# EAGLE design startlight.decoder (EAGLE 7.3.0)
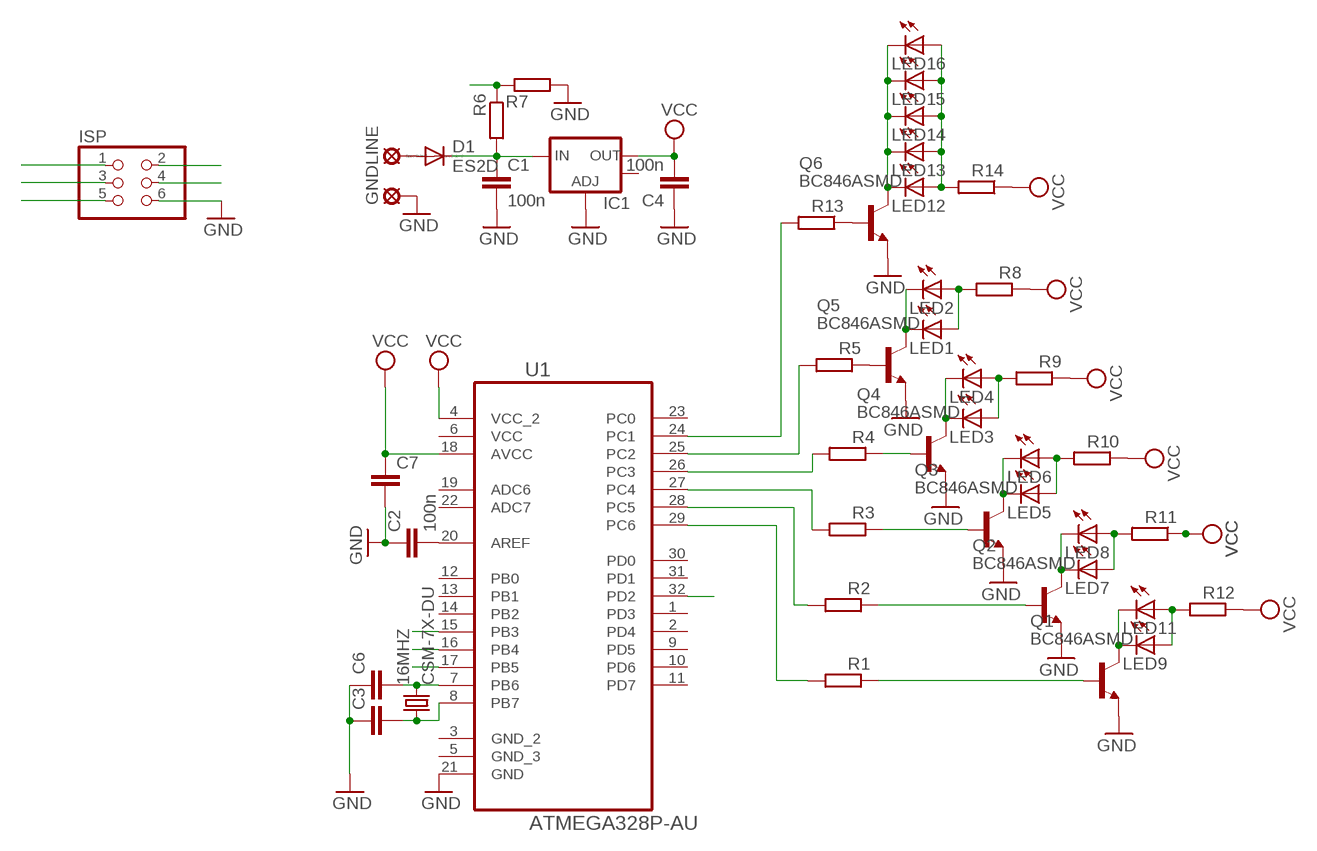
[diagram p0: schematic, sheet 1]

## Parts
16MHZ  CSM-7X-DU  [CSM-7X-DU]
C1  100n  C-EU025-040X050  [C025-040X050]
C2  100n  C-EUC1206  [C1206]
C3  C-EUC0805K  [C0805K]
C4  100n  C-EUC1206  [C1206]
C6  C-EUC0805K  [C0805K]
C7  C-EU025-040X050  [C025-040X050]
D1  ES2D  [SMB]
GND  SE11  [SE11]
IC1  V_REG_LM1117SOT223  [SOT223]
ISP  PINHD-2X3  [2X03]
LED1  LED5MM  [LED5MM]
LED2  LED5MM  [LED5MM]
LED3  LED5MM  [LED5MM]
LED4  LED5MM  [LED5MM]
LED5  LED5MM  [LED5MM]
LED6  LED5MM  [LED5MM]
LED7  LED5MM  [LED5MM]
LED8  LED5MM  [LED5MM]
LED9  LED5MM  [LED5MM]
LED11  LED5MM  [LED5MM]
LED12  LED5MM  [LED5MM]
LED13  LED5MM  [LED5MM]
LED14  LED5MM  [LED5MM]
LED15  LED5MM  [LED5MM]
LED16  LED5MM  [LED5MM]
LINE  SE11  [SE11]
Q1  BC846ASMD  [SOT23]
Q2  BC846ASMD  [SOT23]
Q3  BC846ASMD  [SOT23]
Q4  BC846ASMD  [SOT23]
Q5  BC846ASMD  [SOT23]
Q6  BC846ASMD  [SOT23]
R1  R-EU_R1206  [R1206]
R2  R-EU_R1206  [R1206]
R3  R-EU_R1206  [R1206]
R4  R-EU_R1206  [R1206]
R5  R-EU_R1206  [R1206]
R6  R-EU_R1206  [R1206]
R7  R-EU_R1206  [R1206]
R8  R-EU_R1206  [R1206]
R9  R-EU_R1206  [R1206]
R10  R-EU_R1206  [R1206]
R11  R-EU_R1206  [R1206]
R12  R-EU_R1206  [R1206]
R13  R-EU_R1206  [R1206]
R14  R-EU_R1206  [R1206]
U1  ATMEGA328P-AU  [QFP80P900X900X120-32N]

## Nets
GND: C1.2 C2.1 C3.1 C4.1 C6.1 C7.2 GND.MP IC1.1(ADJ) ISP.6 Q1.2(E) Q2.2(E) Q3.2(E) Q4.2(E) Q5.2(E) Q6.2(E) R7.2 U1.21(GND)
INT0: R6.1 R7.1 U1.32(PD2)
MISO: ISP.1 U1.16(PB4)
MOSI: ISP.4 U1.15(PB3)
N$1: R5.2 U1.25(PC2)
N$2: R4.2 U1.26(PC3)
N$3: R3.2 U1.27(PC4)
N$4: R2.2 U1.28(PC5)
N$5: R1.2 U1.29(PC6)
N$6: Q5.1(B) R5.1
N$7: Q4.1(B) R4.1
N$8: Q3.1(B) R3.1
N$9: Q2.1(B) R2.1
N$10: Q1.1(B) R1.1
N$11: D1.A LINE.MP
N$12: C1.1 D1.C IC1.3(IN) R6.2
N$13: C2.2 U1.20(AREF)
N$14: LED1.K(C) LED2.K(C) Q5.3(C)
N$15: LED3.K(C) LED4.K(C) Q4.3(C)
N$16: LED1.A LED2.A R8.2
N$17: LED5.K(C) LED6.K(C) Q3.3(C)
N$18: LED3.A LED4.A R9.2
N$19: LED7.K(C) LED8.K(C) Q2.3(C)
N$20: LED5.A LED6.A R10.2
N$21: LED9.K(C) LED11.K(C) Q1.3(C)
N$22: LED7.A LED8.A R11.2
N$23: LED9.A LED11.A R12.2
N$24: Q6.1(B) R13.1
N$25: R13.2 U1.24(PC1)
N$26: LED12.K(C) LED13.K(C) LED14.K(C) LED15.K(C) LED16.K(C) Q6.3(C)
N$28: LED12.A LED13.A LED14.A LED15.A LED16.A R14.2
N$30: 16MHZ.2 C6.2 U1.7(PB6)
N$31: 16MHZ.1 C3.2 U1.8(PB7)
RESET: ISP.5
SCK: ISP.3 U1.17(PB5)
VCC: C4.2 C7.1 IC1.2(OUT) ISP.2 R8.1 R9.1 R10.1 R11.1 R12.1 R14.1 U1.4(VCC_2) U1.18(AVCC)
Unconnected: IC1.4(OUT) U1.1(PD3) U1.2(PD4) U1.3(GND_2) U1.5(GND_3) U1.9(PD5) U1.10(PD6) U1.11(PD7) U1.12(PB0) U1.13(PB1) U1.14(PB2) U1.19(ADC6) U1.22(ADC7) U1.23(PC0) U1.30(PD0) U1.31(PD1)

## Power pins joined to a net without a drawn wire
VCC: U1.6(VCC)

## Library data of the parts
16MHZ = quarz:CSM-7X-DU: SMD CRYSTAL Source: www.ecsxtal.com .. Crystal 3.6864MHz CSM_7X_DU.PDF; OC_FARNELL: unknown; OC_NEWARK: unknown
C1-C4 C6 C7 = rcl:C-EU: CAPACITOR, European symbol
D1 = diode:ES2D: DIODE super fast rectifier, 2 A
GND LINE = solpad:SE11: SOLDER PAD RTM, drill 1,1mm, distributor Buerklin, 07F810
IC1 = sparkfun:V_REG_LM1117: Voltage Regulator LM1117 Standard adjustable voltage regulator but in SMD form. Spark Fun Electronics SKU : COM-00595
ISP = pinhead:PINHD-2X3: PIN HEADER
LED1-LED9 LED11-LED16 = led:LED: LED OSRAM: - CHIPLED LG R971, LG N971, LY N971, LG Q971, LY Q971, LO R971, LY R971 LH N974, LH R974 LS Q976, LO Q976, LY Q976 LO Q996 - Hyper CHIPLED LW Q18S LB Q993, LB Q99A, LB R99A - SideLED LS A670, LO A670, LY A670, LG A670, LP A670 LB A673, LV A673, LT A673, LW A673 LH A674 LY A675 LS A676, LA A676, LO A676, LY A676, LW A676 LS A679, LY A679, LG A679 - Hyper Micro SIDELED® LS Y876, LA Y876, LO Y876, LY Y876 LT Y87S - SmartLED LW L88C, LW L88S LB L89C, LB L89S, LG L890 LS L89K, LO L89K, LY L89K LS L896, LA L896, LO L896, LY L896 - TOPLED LS T670, LO T670, LY T670, LG T670, LP T670 LSG T670, LSP T670, LSY T670, LOP T670, LYG T670 LG T671, LOG T671, LSG T671 LB T673, LV T673, LT T673, LW T673 LH T674 LS T676, LA T676, LO T676, LY T676, LB T676, LH T676, LSB T676, LW T676 LB T67C, LV T67C, LT T67C, LS T67K, LO T67K, LY T67K, LW E67C LS E67B, LA E67B, LO E67B, LY E67B, LB E67C, LV E67C, LT E67C LW T67C LS T679, LY T679, LG T679 LS T770, LO T770, LY T770, LG T770, LP T770 LB T773, LV T773, LT T773, LW T773 LH T774 LS E675, LA E675, LY E675, LS T675 LS T776, LA T776, LO T776, LY T776, LB T776 LHGB T686 LT T68C, LB T68C - Hyper Mini TOPLED® LB M676 - Mini TOPLED Santana® LG M470 LS M47K, LO M47K, LY M47K Source: http://www.osram.convergy.de LUXEON: - LUMILED® LXK2-PW12-R00, LXK2-PW12-S00, LXK2-PW14-U00, LXK2-PW14-V00 LXK2-PM12-R00, LXK2-PM12-S00, LXK2-PM14-U00 LXK2-PE12-Q00, LXK2-PE12-R00, LXK2-PE12-S00, LXK2-PE14-T00, LXK2-PE14-U00 LXK2-PB12-K00, LXK2-PB12-L00, LXK2-PB12-M00, LXK2-PB14-N00, LXK2-PB14-P00, LXK2-PB14-Q00 LXK2-PR12-L00, LXK2-PR12-M00, LXK2-PR14-Q00, LXK2-PR14-R00 LXK2-PD12-Q00, LXK2-PD12-R00, LXK2-PD12-S00 LXK2-PH12-R00, LXK2-PH12-S00 LXK2-PL12-P00, LXK2-PL12-Q00, LXK2-PL12-R00 Source: www.luxeon.com KINGBRIGHT: KA-3528ASYC Source: www.kingbright.com
Q1-Q6 = transistor-npn:BC846*: NPN Transistor
R1-R14 = rcl:R-EU_: RESISTOR, European symbol
U1 = atmega328:ATMEGA328P-AU: 8-bit Microcontroller with In-System Programmable Flash; MPN: ATMEGA328P-AU; OC_FARNELL: 1715486; OC_NEWARK: 14R4631; PACKAGE: TQFP-32; SUPPLIER: Atmel

## Net classes
0 default: width 0.406 mm, drill 0.406 mm, clearance 0.406 mm

## Board
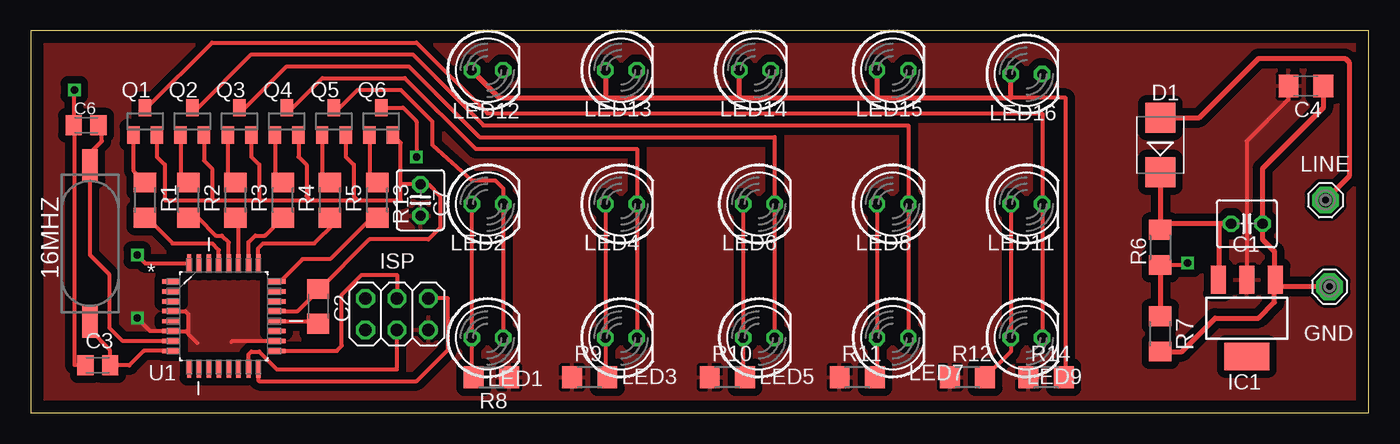
[diagram p1: board, top side]
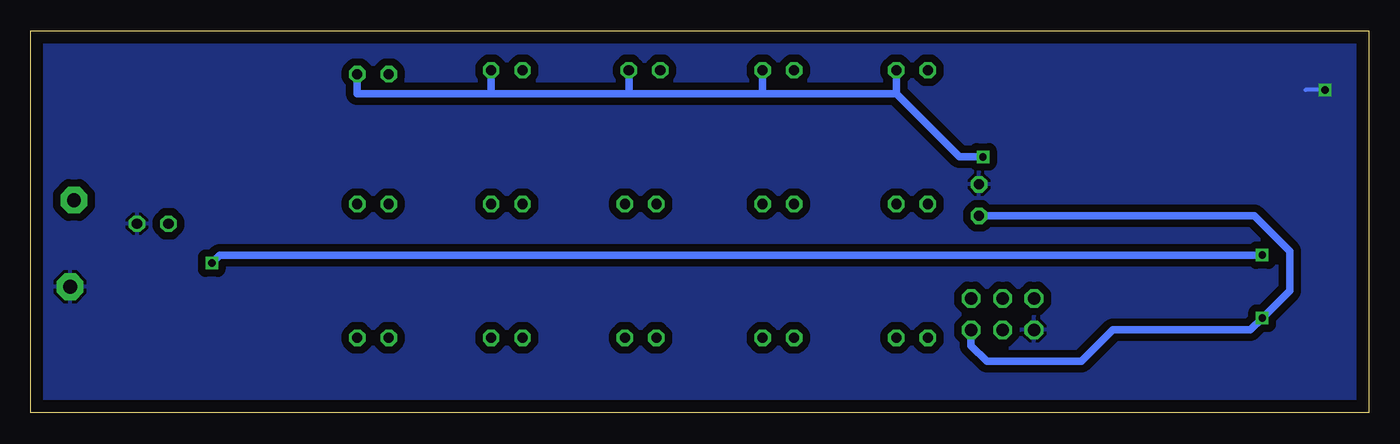
[diagram p2: board, bottom side, seen from below]

Size 107.93 x 30.79 mm. Coordinates in mm from the lower left corner, seen from the top.
Outline: 0,0 107.93,0 107.93,30.79 0,30.79 0,0
Copper layers (1*16): Top 0.035mm / dielectric 1.5mm / Bottom 0.035mm
Design rules "default": minimum track width 10mil, minimum drill 24mil, track to track 8mil, track to pad 8mil, pad to pad 8mil, via to via 8mil, smd to smd 8mil, copper to edge 40mil, drill to drill 8mil, minimum pad ring 10mil, minimum via ring 8mil, stop-mask expansion 4mil, vias tented up to drill 0mil, thermal gap 10mil

### Footprints (pad centres in the part's own frame; a part is rotated, then mirrored left to right if it is on the bottom)
CSM-7X-DU = smd 2.54 x 1.27: 1 -6.338,0; 2 6.338,0
C025-040X050 = drill 0.813 octagon: 1 -1.27,0; 2 1.27,0
C1206 = smd 1.6 x 1.8: 1 -1.4,0; 2 1.4,0
C0805K = smd 1.3 x 1.6: 1 -1,0; 2 1,0
SMB = smd 2.4 x 2.4: A 2.2,0; C -2.2,0
SE11 = drill 1.118 pad 2.159 octagon: MP 0,0
SOT223 = smd 1.219 x 2.235: 1 -2.311,-3.099; 2 0,-3.099; 3 2.311,-3.099 | smd 3.6 x 2.2: 4 0,3.099
2X03 = drill 1.016 octagon: 1 -2.54,-1.27; 2 -2.54,1.27; 3 0,-1.27; 4 0,1.27; 5 2.54,-1.27; 6 2.54,1.27
LED5MM = drill 0.813 octagon: A -1.27,0; K 1.27,0
SOT23 = smd 1 x 1.4: 1 -0.95,-1.1; 2 0.95,-1.1; 3 0,1.1
R1206 = smd 1.6 x 1.803: 1 -1.422,0; 2 1.422,0
QFP80P900X900X120-32N = smd 1.473 x 0.356: 1 -4.242,2.794; 2 -4.242,2.007; 3 -4.242,1.194; 4 -4.242,0.406; 5 -4.242,-0.406; 6 -4.242,-1.194; 7 -4.242,-2.007; 8 -4.242,-2.794; 17 4.242,-2.794; 18 4.242,-2.007; 19 4.242,-1.194; 20 4.242,-0.406; 21 4.242,0.406; 22 4.242,1.194; 23 4.242,2.007; 24 4.242,2.794 | smd 0.356 x 1.473: 9 -2.794,-4.242; 10 -2.007,-4.242; 11 -1.194,-4.242; 12 -0.406,-4.242; 13 0.406,-4.242; 14 1.194,-4.242; 15 2.007,-4.242; 16 2.794,-4.242; 25 2.794,4.242; 26 2.007,4.242; 27 1.194,4.242; 28 0.406,4.242; 29 -0.406,4.242; 30 -1.194,4.242; 31 -2.007,4.242; 32 -2.794,4.242

### Placement (x,y rotation side)
16MHZ  4.76,13.65 90 top
C1  98.11,15.24 0 top
C2  23.18,8.57 270 top
C3  5.4,3.81 0 top
C4  102.87,26.35 180 top
C6  4.45,23.18 0 top
C7  31.43,17.14 90 top
D1  91.12,21.59 90 top
GND  104.78,10.16 0 top
IC1  98.11,7.62 180 top
ISP  29.53,7.94 180 top
LED1  36.83,6.03 0 top
LED2  36.83,16.83 0 top
LED3  47.62,6.03 0 top
LED4  47.62,16.83 0 top
LED5  58.74,6.03 0 top
LED6  58.74,16.83 0 top
LED7  69.53,6.03 0 top
LED8  69.53,16.83 0 top
LED9  80.33,6.03 0 top
LED11  80.33,16.83 0 top
LED12  36.83,27.62 0 top
LED13  47.62,27.62 0 top
LED14  58.42,27.62 0 top
LED15  69.53,27.62 0 top
LED16  80.33,27.3 0 top
LINE  104.46,17.14 0 top
Q1  9.21,23.5 0 top
Q2  13.02,23.5 0 top
Q3  16.83,23.5 0 top
Q4  20.64,23.5 0 top
Q5  24.45,23.5 0 top
Q6  28.26,23.5 0 top
R1  9.21,17.14 270 top
R2  12.7,17.14 270 top
R3  16.51,17.14 270 top
R4  20.32,17.14 270 top
R5  24.13,17.14 270 top
R6  91.12,13.34 90 top
R7  91.12,6.35 270 top
R8  37.15,2.86 180 top
R9  45.09,2.86 0 top
R10  56.2,2.86 0 top
R11  66.67,2.86 0 top
R12  75.56,2.86 0 top
R13  27.94,17.14 270 top
R14  81.92,2.86 0 top
U1  15.56,7.78 0 top

### Tracks (layer width: path | path; a pad name or v marks a point on that pad's centre or on a via)
GND  (via drill 0.6 pad 0.61)
  Top 0.305: 14.61,17.14 10.79,17.14 10.79,20 10.16,20.64 Q1.2 | 14.61,17.14 18.41,17.14 | 18.41,17.14 22.54,17.14 | 22.54,17.14 26.35,17.14 | 26.35,17.14 29.84,17.14 29.84,18.41 | 29.84,18.41 29.84,21.76 Q6.2 | 29.84,18.41 C7.2 32.07,18.41 33.02,17.46 33.02,14.92 32.07,13.97 27.3,13.97 23.31,9.97 C2.1 23.68,9.84 23.18,9.84 21.52,8.19 U1.21 | C3.1 3.81,3.81 3.76,3.86 3.49,3.86 3.49,23.18 | C6.1 3.49,23.18 | 3.49,23.18 v3.49,26.04 | Q2.2 13.97,20.32 14.61,19.68 14.61,17.14 | Q3.2 17.78,20.64 18.41,20 18.41,17.14 | Q4.2 21.59,20.64 22.23,20 22.23,17.46 22.54,17.14 | Q5.2 25.4,20.64 26.04,20 26.04,17.46 26.35,17.14
  Top 0.406: GND.MP 100.98,10.16 100.81,10.32 | 100.81,10.32 IC1.1 100.33,10.81 100.33,13.02 99.38,13.97 C1.2 99.38,19.68 104.27,24.58 C4.1 | R7.2 92.88,4.93 95.57,7.62 99.06,7.62 100.33,8.89 100.33,9.84 100.81,10.32
  Bottom 0.305: v3.49,26.04 5.08,26.04
  pour Bottom (isolate 0.61): 0,0 0,30.8 107.95,30.48 107.95,-0.32
INT0  (via drill 0.6 pad 0.61)
  Top 0.305: 12.72,12.06 U1.32 9.25,12.02 v8.57,12.7 | R6.1 93.19,11.91 v93.34,12.06
  Top 0.406: R6.1 R7.1
  Bottom 0.61: v8.57,12.7 92.71,12.7 v93.34,12.06
MISO
  Top 0.305: ISP.1 33.66,9.21 33.66,5.08 31.11,2.54 18.41,2.54 18.35,2.6 U1.16
MOSI
  Top 0.305: ISP.4 29.53,3.49 19.84,3.49 18.41,4.92 17.78,4.92 17.56,4.71 U1.15
N$1
  Top 0.305: R5.2 24.45,15.24 22.86,13.65 18.73,13.65 18.35,13.27 U1.25
N$2
  Top 0.305: U1.26 17.56,13.75 18.1,14.29 18.88,14.29 R4.2
N$3
  Top 0.305: U1.27 16.75,15.33 R3.2
N$4
  Top 0.305: 12.85,15.72 R2.2 13.49,15.72 14.92,14.29 15.4,14.29 15.96,13.73 U1.28
N$5
  Top 0.305: U1.29 15.15,13.11 14.61,13.65 11.43,13.65 9.36,15.72 R1.2
N$6
  Top 0.305: Q5.1 23.5,19.2 R5.1
N$7
  Top 0.305: Q4.1 19.69,19.2 R4.1
N$8
  Top 0.305: Q3.1 15.88,19.2 R3.1
N$9
  Top 0.305: Q2.1 12.07,19.2 R2.1
N$10
  Top 0.305: Q1.1 8.26,19.52 R1.1
N$11
  Top 0.406: D1.A 94.28,23.79 99.06,28.57 106.05,28.57 106.36,28.26 106.36,19.05 LINE.MP
N$12
  Top 0.406: D1.C 91.12,15.24 | 91.12,15.24 R6.2 | C1.1 95.89,15.24 | 95.89,15.24 91.12,15.24 | IC1.3 95.89,10.72 95.89,15.24
N$13
  Top 0.305: U1.20 23.61,7.37 C2.2
N$14
  Top 0.305: LED1.K LED2.K 38.1,18.1 37.47,18.73 35.56,18.73 32.38,21.59 32.38,23.5 29.84,26.04 26.35,26.04 24.91,24.59 Q5.3
N$15
  Top 0.305: LED3.K LED4.K 48.9,21.27 35.88,21.27 30.16,26.99 23.5,26.99 21.1,24.59 Q4.3
N$16
  Top 0.305: LED2.A LED1.A 35.56,3.02 R8.2
N$17
  Top 0.305: LED5.K LED6.K 60.01,22.23 36.2,22.23 30.48,27.94 20.64,27.94 17.29,24.59 Q3.3
N$18
  Top 0.305: LED4.A LED3.A 46.35,3.34 R9.2
N$19
  Top 0.305: LED7.K LED8.K 70.8,23.18 36.51,23.18 30.8,28.89 17.78,28.89 13.48,24.59 Q2.3
N$20
  Top 0.305: LED6.A LED5.A 57.47,3.33 R10.2
N$21
  Top 0.305: LED9.K LED11.K 81.6,24.13 36.83,24.13 31.11,29.84 14.61,29.84 9.36,24.59 Q1.3
N$22
  Top 0.305: LED8.A LED7.A 68.26,3.02 R11.2
N$23
  Top 0.305: LED11.A LED9.A 79.06,4.93 R12.2
N$24
  Top 0.305: Q6.1 27.31,19.2 R13.1
N$25
  Top 0.305: U1.24 20.1,10.57 21.91,12.38 24.13,12.38 27.47,15.72 R13.2
N$26  (via drill 0.6 pad 0.61)
  Top 0.305: Q6.3 30.02,24.59 31.11,23.5 v31.11,20.64
  Bottom 0.61: v31.11,20.64 33.02,20.64 38.1,25.72 | 38.1,25.72 48.9,25.72 | 48.9,25.72 59.69,25.72 | 59.69,25.72 70.8,25.72 | 70.8,25.72 81.6,25.72 LED16.K | LED15.K 70.8,25.72 | LED12.K 38.1,25.72 | LED13.K 48.9,25.72 | LED14.K 59.69,25.72
N$28
  Top 0.305: R14.2 83.5,2.86 83.5,25.4 79.06,25.4
  Top 0.406: LED12.A 37.78,25.4 46.35,25.4 | 46.35,25.4 57.15,25.4 | 57.15,25.4 68.26,25.4 | 68.26,25.4 79.06,25.4 LED16.A | LED15.A 68.26,25.4 | LED14.A 57.15,25.4 | LED13.A 46.35,25.4
N$30
  Top 0.305: C6.2 5.71,23.13 5.71,21.91 4.76,20.95 16MHZ.2 4.76,12.7 6.35,11.11 6.35,6.83 7.4,5.77 U1.7
N$31
  Top 0.305: 16MHZ.1 4.76,6.67 6.35,5.08 6.35,3.86 C3.2 7.94,3.81 9.11,4.99 U1.8
SCK
  Top 0.305: ISP.3 29.53,11.11 26.67,11.11 25.08,9.53 25.08,5.4 24.67,4.99 U1.17
VCC  (via drill 0.6 pad 0.61)
  Top 0.305: 12.7,6.67 12.7,7.94 12.45,8.19 U1.4 | 12.7,6.67 12.7,6.35 13.44,5.61 | 12.7,6.67 12.62,6.58 U1.6 9.61,6.58 v8.57,7.62 | C4.2 101.47,25.27 98.11,21.91 IC1.2 | U1.18 16.25,5.77 16.19,5.71
  Bottom 0.61: ISP.2 32.07,5.4 30.8,4.13 23.18,4.13 20.64,6.67 9.53,6.67 v8.57,7.62 6.35,9.84 6.35,13.02 9.21,15.88 C7.1
  pour Top (isolate 0.61): 0,30.8 107.95,30.8 107.95,0 0,0